# Altium project BugBuster_DAQ.PrjPcb (part 1 of 3)
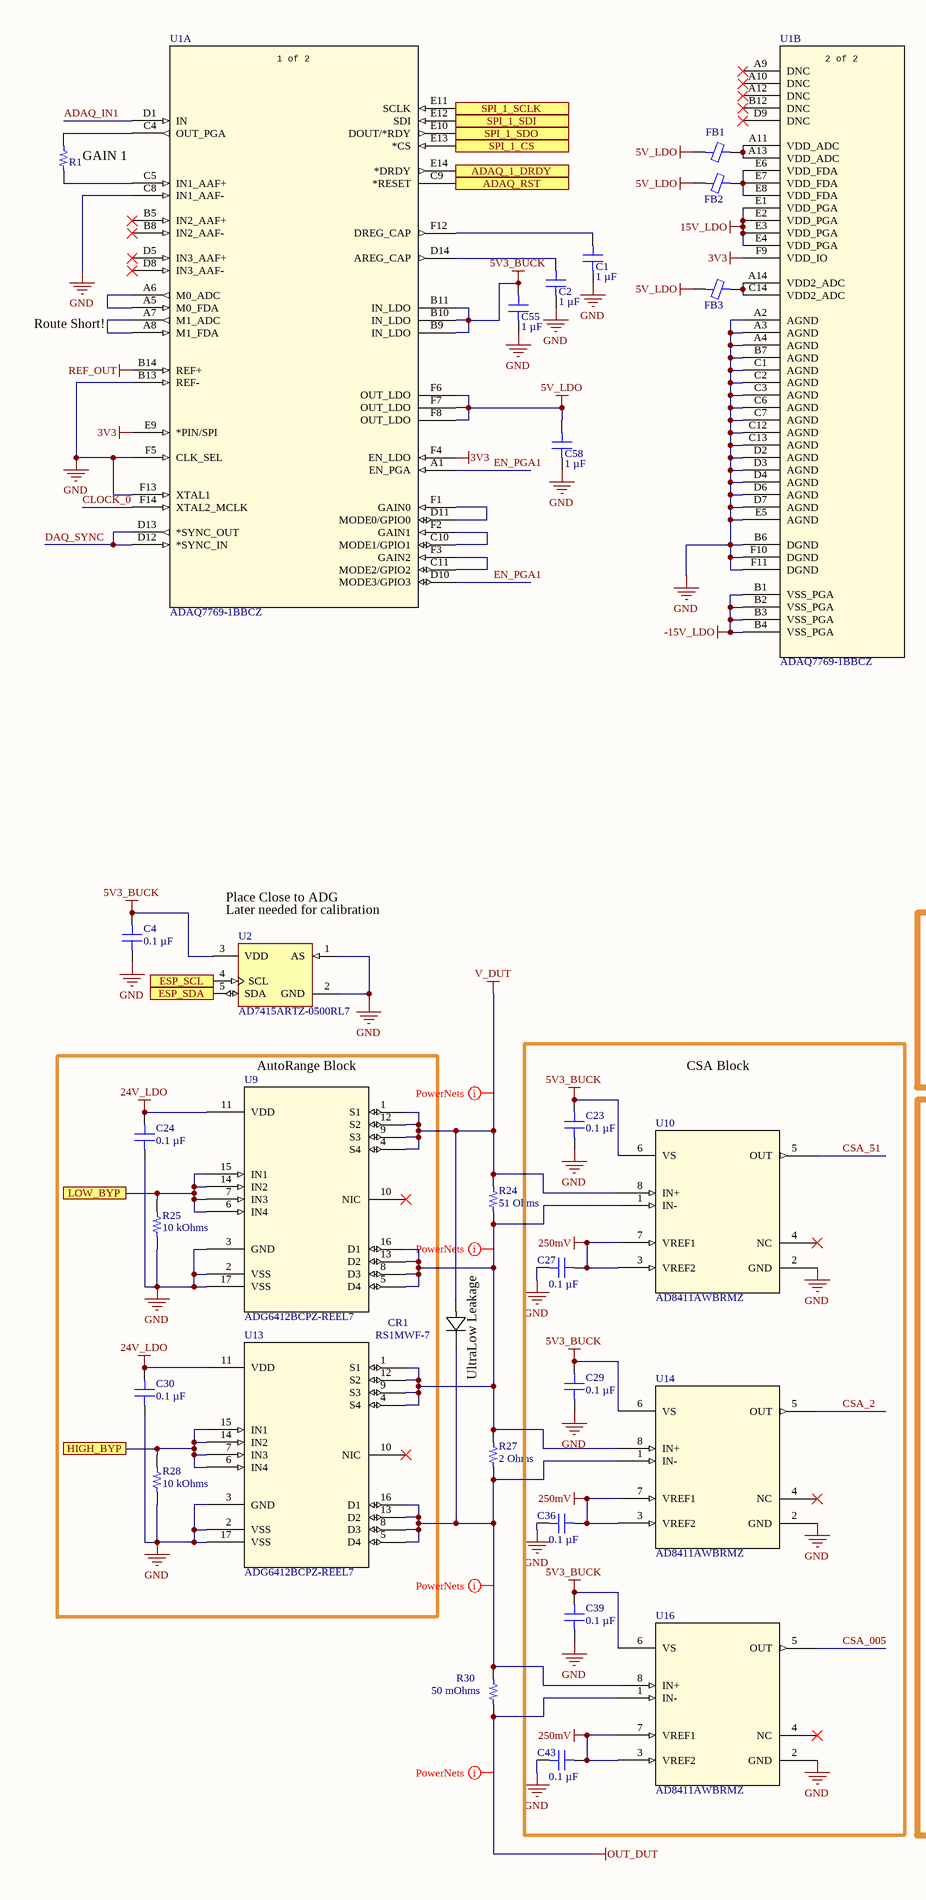
[diagram p0: DAQ.SchDoc, left]
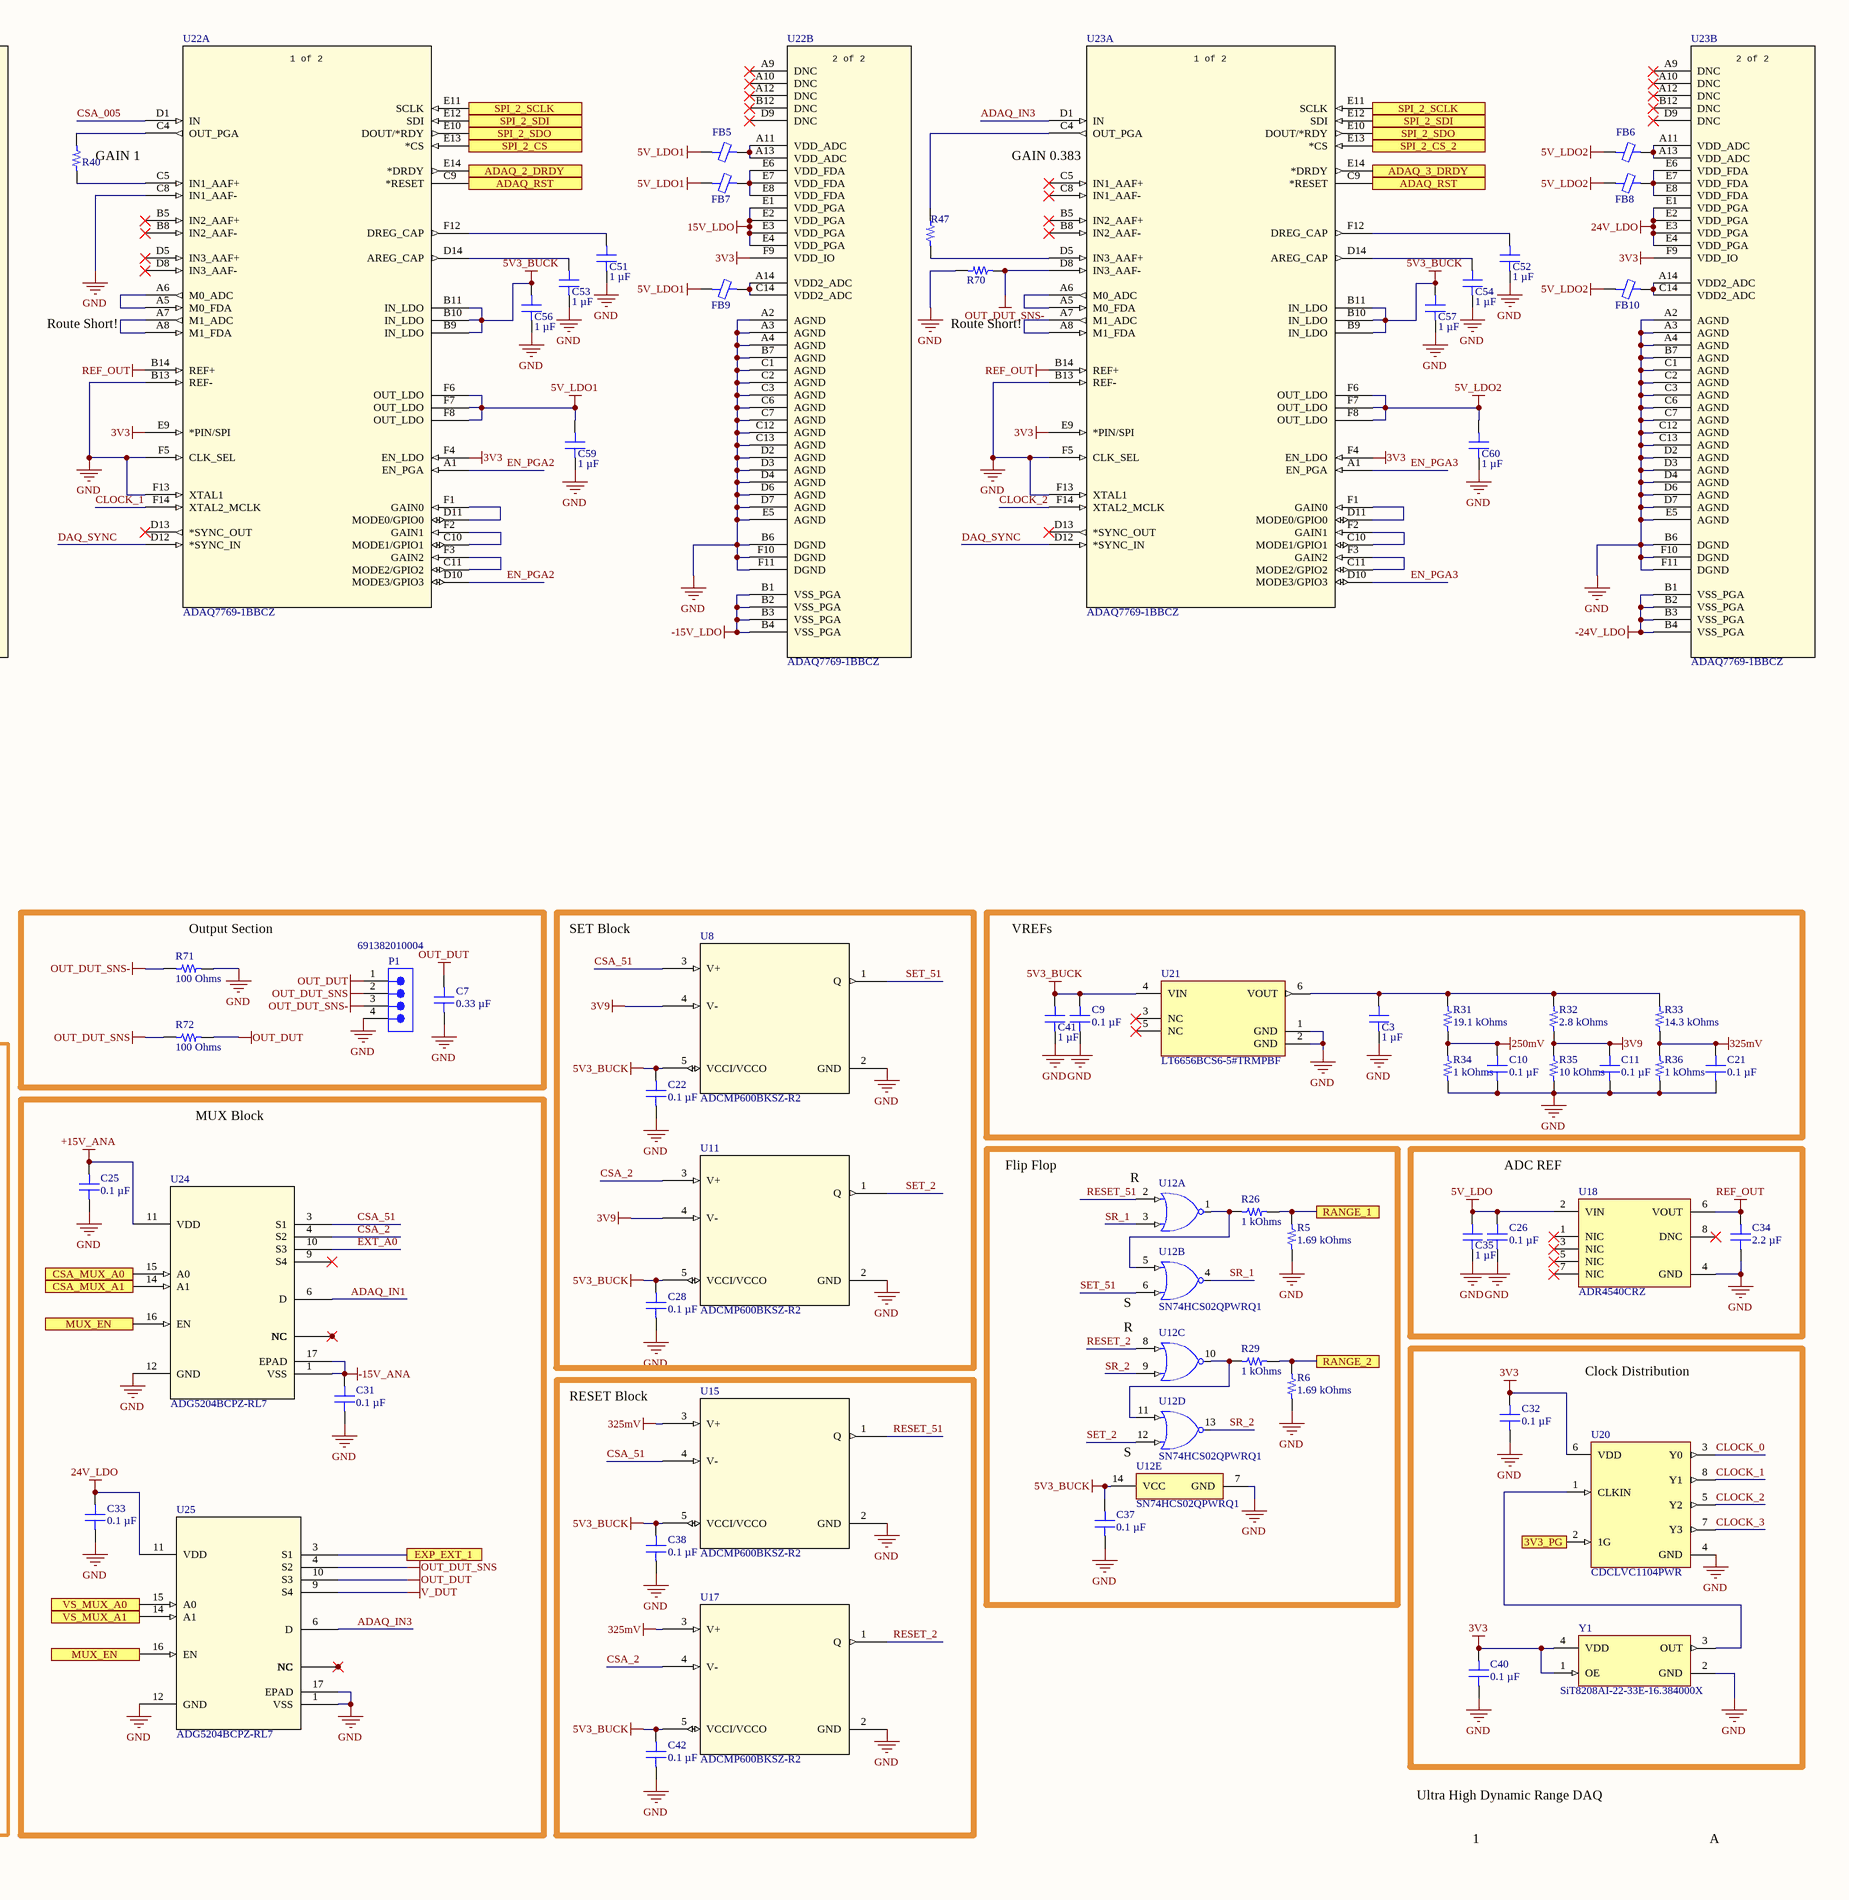
[diagram p1: DAQ.SchDoc, right]
5 sheets, 245 parts. Net scope: flat (ports and power ports of the same name join across sheets).
Board file: BugBuster_DAQ.PcbDoc
Sheets:
  DAQ.SchDoc
  Power.SchDoc
  IOs.SchDoc
  ESP32P4.SchDoc
  LCD.SchDoc

## Sheet DAQ.SchDoc
size A2; SheetNumber: 1; SheetTotal: 5

### Parts
C1  1 µF  [CAP 0603_1608]
C2  1 µF  [CAP 0603_1608]
C3  1 µF  [CAP 0603_1608]
C4  0.1 µF  [CAP 0603_1608]
C7  0.33 µF  [CAP 1206_3216 - 0.8MM]
C9  0.1 µF  [CAP 0603_1608]
C10  0.1 µF  [CAP 0603_1608]
C11  0.1 µF  [CAP 0603_1608]
C21  0.1 µF  [CAP 0603_1608]
C22  0.1 µF  [CAP 0603_1608]
C23  0.1 µF  [CAP 0603_1608]
C24  0.1 µF  [CAP 0603_1608]
C25  0.1 µF  [CAP 0603_1608]
C26  0.1 µF  [CAP 0603_1608]
C27  0.1 µF  [CAP 0603_1608]
C28  0.1 µF  [CAP 0603_1608]
C29  0.1 µF  [CAP 0603_1608]
C30  0.1 µF  [CAP 0603_1608]
C31  0.1 µF  [CAP 0603_1608]
C32  0.1 µF  [CAP 0603_1608]
C33  0.1 µF  [CAP 0603_1608]
C34  2.2 µF  [CAP 0805_2012]
C35  1 µF  [CAP 0603_1608]
C36  0.1 µF  [CAP 0603_1608]
C37  0.1 µF  [CAP 0603_1608]
C38  0.1 µF  [CAP 0603_1608]
C39  0.1 µF  [CAP 0603_1608]
C40  0.1 µF  [CAP 0603_1608]
C41  1 µF  [CAP 0603_1608]
C42  0.1 µF  [CAP 0603_1608]
C43  0.1 µF  [CAP 0603_1608]
C51  1 µF  [CAP 0603_1608]
C52  1 µF  [CAP 0603_1608]
C53  1 µF  [CAP 0603_1608]
C54  1 µF  [CAP 0603_1608]
C55  1 µF  [CAP 0603_1608]
C56  1 µF  [CAP 0603_1608]
C57  1 µF  [CAP 0603_1608]
C58  1 µF  [CAP 0603_1608]
C59  1 µF  [CAP 0603_1608]
C60  1 µF  [CAP 0603_1608]
CR1  RS1MWF-7  [SOD123F_RS1MWF_DIO]
FB1  1000 Ohms @ 100 MHz  [FER 0603_1608]  (value not drawn)
FB2  1000 Ohms @ 100 MHz  [FER 0603_1608]  (value not drawn)
FB3  1000 Ohms @ 100 MHz  [FER 0603_1608]  (value not drawn)
FB5  1000 Ohms @ 100 MHz  [FER 0603_1608]  (value not drawn)
FB6  1000 Ohms @ 100 MHz  [FER 0603_1608]  (value not drawn)
FB7  1000 Ohms @ 100 MHz  [FER 0603_1608]  (value not drawn)
FB8  1000 Ohms @ 100 MHz  [FER 0603_1608]  (value not drawn)
FB9  1000 Ohms @ 100 MHz  [FER 0603_1608]  (value not drawn)
FB10  1000 Ohms @ 100 MHz  [FER 0603_1608]  (value not drawn)
P1  691382010004  [691382010004]
R1  0 Ohms  [RES 0603_1608]  (value not drawn)
R5  1.69 kOhms  [RES 0603_1608]
R6  1.69 kOhms  [RES 0603_1608]
R24  51 Ohms  [STACKPOLE CSR2512]
R25  10 kOhms  [RES 0603_1608]
R26  1 kOhms  [RES 0603_1608]
R27  2 Ohms  [STACKPOLE CSR2512]
R28  10 kOhms  [RES 0603_1608]
R29  1 kOhms  [RES 0603_1608]
R30  50 mOhms  [TE TLRP 2512]
R31  19.1 kOhms  [RES 0603_1608]
R32  2.8 kOhms  [RES 0603_1608]
R33  14.3 kOhms  [RES 0603_1608]
R34  1 kOhms  [RES 0603_1608]
R35  10 kOhms  [RES 0603_1608]
R36  1 kOhms  [RES 0603_1608]
R40  0 Ohms  [RES 0603_1608]  (value not drawn)
R47  0 Ohms  [RES 0603_1608]  (value not drawn)
R70  0 Ohms  [RES 0603_1608]  (value not drawn)
R71  100 Ohms  [RES 0603_1608]
R72  100 Ohms  [RES 0603_1608]
U1  ADAQ7769-1BBCZ  [BC-84-4_ADI]  (parts A,B of 2)
U2  AD7415ARTZ-0500RL7  [ADI-RJ-5_M]
U8  ADCMP600BKSZ-R2  [ADI-KS-5_L]
U9  ADG6412BCPZ-REEL7  [CP_16_17_ADI]
U10  AD8411AWBRMZ  [RM-8_ADI]
U11  ADCMP600BKSZ-R2  [ADI-KS-5_L]
U12  SN74HCS02QPWRQ1  [FP-PW0014A-IPC_B]  (value not drawn)  (parts A,B,C,D,E of 5)
U13  ADG6412BCPZ-REEL7  [CP_16_17_ADI]
U14  AD8411AWBRMZ  [RM-8_ADI]
U15  ADCMP600BKSZ-R2  [ADI-KS-5_L]
U16  AD8411AWBRMZ  [RM-8_ADI]
U17  ADCMP600BKSZ-R2  [ADI-KS-5_L]
U18  ADR4540CRZ  [FP-R-8-IPC_C]
U20  CDCLVC1104PWR  [FP-PW0008A-MFG]
U21  LT6656BCS6-5#TRMPBF  [FP-S6-6-05-08-1636-IPC_B]
U22  ADAQ7769-1BBCZ  [BC-84-4_ADI]  (parts A,B of 2)
U23  ADAQ7769-1BBCZ  [BC-84-4_ADI]  (parts A,B of 2)
U24  ADG5204BCPZ-RL7  [CP_16_17_ADI]
U25  ADG5204BCPZ-RL7  [CP_16_17_ADI]
Y1  SiT8208AI-22-33E-16.384000X  [FP-SiT8208-2-MFG]

### Blocks framed on the sheet
Output Section: C7 P1 R71 R72
SET Block: C22 C28 U8 U11
VREFs: C3 C9-C11 C21 C41 R31-R36 U21
CSA Block: C23 C27 C29 C36 C39 C43 U10 U14 U16
AutoRange Block: C24 C30 R25 R28 U9 U13
MUX Block: C25 C31 C33 U24 U25
ADC REF: C26 C34 C35 U18
RESET Block: C38 C42 U15 U17
Clock Distribution: C32 C40 U20 Y1

### Ports
3V3_PG, ADAQ_1_DRDY, ADAQ_2_DRDY, ADAQ_3_DRDY, ADAQ_RST, CSA_MUX_A0, CSA_MUX_A1, ESP_SCL, ESP_SDA, EXP_EXT_1, HIGH_BYP, LOW_BYP, MUX_EN, RANGE_1, RANGE_2, SPI_1_CS, SPI_1_SCLK, SPI_1_SDI, SPI_1_SDO, SPI_2_CS, SPI_2_CS_2, SPI_2_SCLK, SPI_2_SDI, SPI_2_SDO, VS_MUX_A0, VS_MUX_A1

### Nets
3V3: C32.2 C40.2 U1.E9(*PIN/SPI) U1.F4(EN_LDO) U1.F9(VDD_IO) U20.6(VDD) U22.E9(*PIN/SPI) U22.F4(EN_LDO) U22.F9(VDD_IO) U23.E9(*PIN/SPI) U23.F4(EN_LDO) U23.F9(VDD_IO) Y1.1(OE) Y1.4(VDD)
3V9: C11.2 R32.1 R35.2 U8.4(V-) U11.4(V-)
5V3_BUCK: C4.2 C9.2 C22.2 C23.2 C28.2 C29.2 C37.2 C38.2 C39.2 C41.2 C42.2 C55.2 C56.2 C57.2 U1.B9(IN_LDO) U1.B10(IN_LDO) U1.B11(IN_LDO) U2.3(VDD) U8.5(VCCI/VCCO) U10.6(VS) U11.5(VCCI/VCCO) U12.14(VCC) U14.6(VS) U15.5(VCCI/VCCO) U16.6(VS) U17.5(VCCI/VCCO) U21.4(VIN) U22.B9(IN_LDO) U22.B10(IN_LDO) U22.B11(IN_LDO) U23.B9(IN_LDO) U23.B10(IN_LDO) U23.B11(IN_LDO)
5V_LDO: C26.2 C35.2 C58.2 FB1.1 FB2.1 FB3.1 U1.F6(OUT_LDO) U1.F7(OUT_LDO) U1.F8(OUT_LDO) U18.2(VIN)
5V_LDO1: C59.2 FB5.1 FB7.1 FB9.1 U22.F6(OUT_LDO) U22.F7(OUT_LDO) U22.F8(OUT_LDO)
5V_LDO2: C60.2 FB6.1 FB8.1 FB10.1 U23.F6(OUT_LDO) U23.F7(OUT_LDO) U23.F8(OUT_LDO)
15V_LDO: U1.E1(VDD_PGA) U1.E2(VDD_PGA) U1.E3(VDD_PGA) U1.E4(VDD_PGA) U22.E1(VDD_PGA) U22.E2(VDD_PGA) U22.E3(VDD_PGA) U22.E4(VDD_PGA)
24V_LDO: C24.2 C30.2 C33.2 U9.11(VDD) U13.11(VDD) U23.E1(VDD_PGA) U23.E2(VDD_PGA) U23.E3(VDD_PGA) U23.E4(VDD_PGA) U25.11(VDD)
250mV: C10.2 C27.1 C36.1 C43.1 R31.1 R34.2 U10.3(VREF2) U10.7(VREF1) U14.3(VREF2) U14.7(VREF1) U16.3(VREF2) U16.7(VREF1)
325mV: C21.2 R33.1 R36.2 U15.3(V+) U17.3(V+)
+15V_ANA: C25.2 U24.11(VDD)
-15V_ANA: C31.2 U24.1(VSS) U24.17(EPAD)
-15V_LDO: U1.B1(VSS_PGA) U1.B2(VSS_PGA) U1.B3(VSS_PGA) U1.B4(VSS_PGA) U22.B1(VSS_PGA) U22.B2(VSS_PGA) U22.B3(VSS_PGA) U22.B4(VSS_PGA)
-24V_LDO: U23.B1(VSS_PGA) U23.B2(VSS_PGA) U23.B3(VSS_PGA) U23.B4(VSS_PGA)
GND: C1.1 C2.1 C3.1 C4.1 C7.1 C9.1 C10.1 C11.1 C21.1 C22.1 C23.1 C24.1 C25.1 C26.1 C27.2 C28.1 C29.1 C30.1 C31.1 C32.1 C33.1 C34.1 C35.1 C36.2 C37.1 C38.1 C39.1 C40.1 C41.1 C42.1 C43.2 C51.1 C52.1 C53.1 C54.1 C55.1 C56.1 C57.1 C58.1 C59.1 C60.1 P1.4 R5.1 R6.1 R25.1 R28.1 R34.1 R35.1 R36.1 R70.2 R71.2 U1.A2(AGND) U1.A3(AGND) U1.A4(AGND) U1.B6(DGND) U1.B7(AGND) U1.B13(REF-) U1.C1(AGND) U1.C2(AGND) U1.C3(AGND) U1.C6(AGND) U1.C7(AGND) U1.C8(IN1_AAF-) U1.C12(AGND) U1.C13(AGND) U1.D2(AGND) U1.D3(AGND) U1.D4(AGND) U1.D6(AGND) U1.D7(AGND) U1.E5(AGND) U1.F5(CLK_SEL) U1.F10(DGND) U1.F11(DGND) U1.F13(XTAL1) U2.1(AS) U2.2(GND) U8.2(GND) U9.2(VSS) U9.3(GND) U9.17(VSS) U10.2(GND) U11.2(GND) U12.7(GND) U13.2(VSS) U13.3(GND) U13.17(VSS) U14.2(GND) U15.2(GND) U16.2(GND) U17.2(GND) U18.4(GND) U20.4(GND) U21.1(GND) U21.2(GND) U22.A2(AGND) U22.A3(AGND) U22.A4(AGND) U22.B6(DGND) U22.B7(AGND) U22.B13(REF-) U22.C1(AGND) U22.C2(AGND) U22.C3(AGND) U22.C6(AGND) U22.C7(AGND) U22.C8(IN1_AAF-) U22.C12(AGND) U22.C13(AGND) U22.D2(AGND) U22.D3(AGND) U22.D4(AGND) U22.D6(AGND) U22.D7(AGND) U22.E5(AGND) U22.F5(CLK_SEL) U22.F10(DGND) U22.F11(DGND) U22.F13(XTAL1) U23.A2(AGND) U23.A3(AGND) U23.A4(AGND) U23.B6(DGND) U23.B7(AGND) U23.B13(REF-) U23.C1(AGND) U23.C2(AGND) U23.C3(AGND) U23.C6(AGND) U23.C7(AGND) U23.C12(AGND) U23.C13(AGND) U23.D2(AGND) U23.D3(AGND) U23.D4(AGND) U23.D6(AGND) U23.D7(AGND) U23.E5(AGND) U23.F5(CLK_SEL) U23.F10(DGND) U23.F11(DGND) U23.F13(XTAL1) U24.12(GND) U25.1(VSS) U25.12(GND) U25.17(EPAD) Y1.2(GND)
OUT_DUT: C7.2 P1.1 R30.1 R72.2 U16.1(IN-) U25.10(S3)
OUT_DUT_SNS: P1.2 R72.1 U25.4(S2)
OUT_DUT_SNS-: P1.3 R70.1 R71.1 U23.D8(IN3_AAF-)
REF_OUT: C34.2 U1.B14(REF+) U18.6(VOUT) U22.B14(REF+) U23.B14(REF+)
V_DUT: CR1.2 R24.2 U9.1(S1) U9.4(S4) U9.9(S3) U9.12(S2) U10.8(IN+) U25.9(S4)
ADAQ_IN1: U1.D1(IN) U24.6(D)
ADAQ_IN3: U23.D1(IN) U25.6(D)
CLOCK_0: U1.F14(XTAL2_MCLK) U20.3(Y0)
CLOCK_1: U20.8(Y1) U22.F14(XTAL2_MCLK)
CLOCK_2: U20.5(Y2) U23.F14(XTAL2_MCLK)
CLOCK_3: U20.7(Y3)
CSA_2: U11.3(V+) U14.5(OUT) U17.4(V-) U24.4(S2)
CSA_005: U16.5(OUT) U22.D1(IN)
CSA_51: U8.3(V+) U10.5(OUT) U15.4(V-) U24.3(S1)
DAQ_SYNC: U1.D12(*SYNC_IN) U1.D13(*SYNC_OUT) U22.D12(*SYNC_IN) U23.D12(*SYNC_IN)
EN_PGA1: U1.A1(EN_PGA) U1.D10(MODE3/GPIO3)
EN_PGA2: U22.A1(EN_PGA) U22.D10(MODE3/GPIO3)
EN_PGA3: U23.A1(EN_PGA) U23.D10(MODE3/GPIO3)
EXT_A0: U24.10(S3)
RESET_2: U12.8(3A) U17.1(Q)
RESET_51: U12.2(1A) U15.1(Q)
SET_2: U11.1(Q) U12.12(4B)
SET_51: U8.1(Q) U12.6(2B)
SR_1: U12.3(1B) U12.4(2Y)
SR_2: U12.9(3B) U12.13(4Y)
NetC1_2: C1.2 U1.F12(DREG_CAP)
NetC2_2: C2.2 U1.D14(AREG_CAP)
NetC3_2: C3.2 R31.2 R32.2 R33.2 U21.6(VOUT)
NetC51_2: C51.2 U22.F12(DREG_CAP)
NetC52_2: C52.2 U23.F12(DREG_CAP)
NetC53_2: C53.2 U22.D14(AREG_CAP)
NetC54_2: C54.2 U23.D14(AREG_CAP)
NetCR1_1: CR1.1 R27.2 R30.2 U13.5(D4) U13.8(D3) U13.13(D2) U13.16(D1) U14.1(IN-) U16.8(IN+)
NetFB1_2: FB1.2 U1.A11(VDD_ADC) U1.A13(VDD_ADC)
NetFB2_2: FB2.2 U1.E6(VDD_FDA) U1.E7(VDD_FDA) U1.E8(VDD_FDA)
NetFB3_2: FB3.2 U1.A14(VDD2_ADC) U1.C14(VDD2_ADC)
NetFB5_2: FB5.2 U22.A11(VDD_ADC) U22.A13(VDD_ADC)
NetFB6_2: FB6.2 U23.A11(VDD_ADC) U23.A13(VDD_ADC)
NetFB7_2: FB7.2 U22.E6(VDD_FDA) U22.E7(VDD_FDA) U22.E8(VDD_FDA)
NetFB8_2: FB8.2 U23.E6(VDD_FDA) U23.E7(VDD_FDA) U23.E8(VDD_FDA)
NetFB9_2: FB9.2 U22.A14(VDD2_ADC) U22.C14(VDD2_ADC)
NetFB10_2: FB10.2 U23.A14(VDD2_ADC) U23.C14(VDD2_ADC)
NetJ3_2: U25.3(S1) ; port EXP_EXT_1
NetR1_1: R1.1 U1.C5(IN1_AAF+)
NetR1_2: R1.2 U1.C4(OUT_PGA)
NetR5_2: R5.2 R26.1 ; port RANGE_1
NetR6_2: R6.2 R29.1 ; port RANGE_2
NetR24_1: R24.1 R27.1 U9.5(D4) U9.8(D3) U9.13(D2) U9.16(D1) U10.1(IN-) U13.1(S1) U13.4(S4) U13.9(S3) U13.12(S2) U14.8(IN+)
NetR25_2: R25.2 U9.6(IN4) U9.7(IN3) U9.14(IN2) U9.15(IN1) ; port LOW_BYP
NetR26_2: R26.2 U12.1(1Y) U12.5(2A)
NetR28_2: R28.2 U13.6(IN4) U13.7(IN3) U13.14(IN2) U13.15(IN1) ; port HIGH_BYP
NetR29_2: R29.2 U12.10(3Y) U12.11(4A)
NetR40_1: R40.1 U22.C5(IN1_AAF+)
NetR40_2: R40.2 U22.C4(OUT_PGA)
NetR47_1: R47.1 U23.D5(IN3_AAF+)
NetR47_2: R47.2 U23.C4(OUT_PGA)
NetR51_1: U20.2(1G) ; port 3V3_PG
NetR68_1: U2.5(SDA) ; port ESP_SDA
NetR69_1: U2.4(SCL) ; port ESP_SCL
NetU1_A5: U1.A5(M0_FDA) U1.A6(M0_ADC)
NetU1_A7: U1.A7(M1_ADC) U1.A8(M1_FDA)
NetU1_C9: U1.C9(*RESET) U22.C9(*RESET) U23.C9(*RESET) ; port ADAQ_RST
NetU1_C10: U1.C10(MODE1/GPIO1) U1.F2(GAIN1)
NetU1_C11: U1.C11(MODE2/GPIO2) U1.F3(GAIN2)
NetU1_D11: U1.D11(MODE0/GPIO0) U1.F1(GAIN0)
NetU1_E10: U1.E10(DOUT/*RDY) ; port SPI_1_SDO
NetU1_E11: U1.E11(SCLK) ; port SPI_1_SCLK
NetU1_E12: U1.E12(SDI) ; port SPI_1_SDI
NetU1_E13: U1.E13(*CS) ; port SPI_1_CS
NetU1_E14: U1.E14(*DRDY) ; port ADAQ_1_DRDY
NetU20_1: U20.1(CLKIN) Y1.3(OUT)
NetU22_A5: U22.A5(M0_FDA) U22.A6(M0_ADC)
NetU22_A7: U22.A7(M1_ADC) U22.A8(M1_FDA)
NetU22_C10: U22.C10(MODE1/GPIO1) U22.F2(GAIN1)
NetU22_C11: U22.C11(MODE2/GPIO2) U22.F3(GAIN2)
NetU22_D11: U22.D11(MODE0/GPIO0) U22.F1(GAIN0)
NetU22_E10: U22.E10(DOUT/*RDY) U23.E10(DOUT/*RDY) ; port SPI_2_SDO
NetU22_E11: U22.E11(SCLK) U23.E11(SCLK) ; port SPI_2_SCLK
NetU22_E12: U22.E12(SDI) U23.E12(SDI) ; port SPI_2_SDI
NetU22_E13: U22.E13(*CS) ; port SPI_2_CS
NetU22_E14: U22.E14(*DRDY) ; port ADAQ_2_DRDY
NetU23_A5: U23.A5(M0_FDA) U23.A6(M0_ADC)
NetU23_A7: U23.A7(M1_ADC) U23.A8(M1_FDA)
NetU23_C10: U23.C10(MODE1/GPIO1) U23.F2(GAIN1)
NetU23_C11: U23.C11(MODE2/GPIO2) U23.F3(GAIN2)
NetU23_D11: U23.D11(MODE0/GPIO0) U23.F1(GAIN0)
NetU23_E13: U23.E13(*CS) ; port SPI_2_CS_2
NetU23_E14: U23.E14(*DRDY) ; port ADAQ_3_DRDY
NetU24_2: U24.2(NC) U24.5(NC) U24.7(NC) U24.8(NC) U24.13(NC)
NetU24_14: U24.14(A1) ; port CSA_MUX_A1
NetU24_15: U24.15(A0) ; port CSA_MUX_A0
NetU24_16: U24.16(EN) U25.16(EN) ; port MUX_EN
NetU25_2: U25.2(NC) U25.5(NC) U25.7(NC) U25.8(NC) U25.13(NC)
NetU25_14: U25.14(A1) ; port VS_MUX_A1
NetU25_15: U25.15(A0) ; port VS_MUX_A0

Not connected (* = marked no-connect by the designer): U1 A9(DNC)* A10(DNC)* A12(DNC)* B5(IN2_AAF+)* B8(IN2_AAF-)* B12(DNC)* D5(IN3_AAF+)* D8(IN3_AAF-)* D9(DNC)*; U9 10(NIC)*; U10 4(NC)*; U13 10(NIC)*; U14 4(NC)*; U16 4(NC)*; U18 1(NIC)* 3(NIC)* 5(NIC)* 7(NIC)* 8(DNC)*; U21 3(NC)* 5(NC)*; U22 A9(DNC)* A10(DNC)* A12(DNC)* B5(IN2_AAF+)* B8(IN2_AAF-)* B12(DNC)* D5(IN3_AAF+)* D8(IN3_AAF-)* D9(DNC)* D13(*SYNC_OUT)*; U23 A9(DNC)* A10(DNC)* A12(DNC)* B5(IN2_AAF+)* B8(IN2_AAF-)* B12(DNC)* C5(IN1_AAF+)* C8(IN1_AAF-)* D9(DNC)* D13(*SYNC_OUT)*; U24 9(S4)*

### Layout directives
net class PowerNets: NetCR1_1, NetR24_1, OUT_DUT, V_DUT

### Notes on the sheet
- (near R1) GAIN 1
- (near R40) GAIN 1
- (near U23) GAIN 0.383
- Route Short!
- Place Close to ADG
- (near U2) Later needed for calibration
- Flip Flop
- (near U12) R
- (near U12) S
- (near CR1) UltraLow Leakage
- Ultra High Dynamic Range DAQ
- 1
- A
- (in symbol ADAQ7769-1BBCZ, part A) 1 of 2
- (in symbol ADAQ7769-1BBCZ, part B) 2 of 2

### Library data of the parts
C1-C3 C35 C41 C51-C60 = GMC10X7R105M50NT: SMT Capacitor; manufacturer: Cal-Chip Electronics, Inc.; Temperature Coefficient: X7R; Tolerance: ±20%; Voltage - Rated: 50V; Part Number: GMC10X7R105M50NT; Applications: General Purpose; Capacitance: 1 µF; componentlink1description: Datasheet; componentlink1url: https://calchip.com/wp-content/uploads/2024/02/gmc_series-1.pdf; componentlink2description: DigiKey Link; componentlink2url: https://www.digikey.com/en/products/detail/cal-chip-electronics-inc/GMC10X7R105M50NT/25323876; Device Package: 0603 (1608 Metric); lastupdated: 06/04/2026 19:17:52; Lifecycle Status: Active; Minimum Order: 1; Mounting Type: Surface Mount, MLCC; Operating Temperature: -55°C ~ 125°C; Package / Case: 0603 (1608 Metric); packaging: TapeAndReel; partid: 65934; price: 0.06; series: GMC; Size / Dimension: 0.063" L x 0.031" W (1.60mm x 0.80mm); Supplier 1: DigiKey; Supplier Part Number 1: 4713-GMC10X7R105M50NTCT-ND; Thickness (Max): 0.037" (0.95mm); value: 1 µF
C4 C9-C11 C21-C33 C36-C40 C42 C43 = C0603C104M5RACTU: SMT Capacitor; manufacturer: KEMET; Temperature Coefficient: X7R; Tolerance: ±20%; Voltage - Rated: 50V; Part Number: C0603C104M5RACTU; value: 0.1 µF; Applications: Bypass, Decoupling; Capacitance: 0.1 µF; componentlink1description: Datasheet; componentlink1url: https://api.kemet.com/component-edge/download/datasheet/C0603C104M5RACTU.pdf; componentlink2description: DigiKey Link; componentlink2url: https://www.digikey.com/en/products/detail/kemet/C0603C104M5RACTU/2199782; Device Package: 0603 (1608 Metric); lastupdated: 06/04/2026 19:22:47; Lifecycle Status: Active; Minimum Order: 1; Mounting Type: Surface Mount, MLCC; Operating Temperature: -55°C ~ 125°C; Package / Case: 0603 (1608 Metric); packaging: CutTape; partid: 69106; Part Status: Active; price: 0.01; series: SMD Comm X7R; Size / Dimension: 0.063" L x 0.031" W (1.60mm x 0.80mm); Supplier 1: DigiKey; Supplier Part Number 1: 399-C0603C104M5RACTUCT-ND; Thickness (Max): 0.034" (0.87mm)
C7 = CGA5L3X8R2A334K160AB: SMT Capacitor; manufacturer: TDK Corporation; Temperature Coefficient: X8R; Tolerance: ±10%; Voltage - Rated: 100V; Part Number: CGA5L3X8R2A334K160AB; Applications: Automotive; Capacitance: 0.33 µF; componentlink1description: Datasheet; componentlink1url: https://product.tdk.com/info/en/catalog/datasheets/mlcc_automotive_hightemp_en.pdf?ref_disty=digikey; componentlink2description: DigiKey Link; componentlink2url: https://www.digikey.com/en/products/detail/tdk-corporation/CGA5L3X8R2A334K160AB/3950213; Device Package: 1206 (3216 Metric); Features: High Temperature; lastupdated: 06/04/2026 19:37:59; Lifecycle Status: Active; Minimum Order: 1; Mounting Type: Surface Mount, MLCC; Operating Temperature: -55°C ~ 150°C; Package / Case: 1206 (3216 Metric); packaging: TapeAndReel; partid: 19758; Part Status: Active; price: 0.15; Ratings: AEC-Q200; series: CGA; Size / Dimension: 0.126" L x 0.063" W (3.20mm x 1.60mm); Supplier 1: DigiKey; Supplier Part Number 1: 445-12977-1-ND; Thickness (Max): 0.071" (1.80mm); value: 0.33 µF
C34 = GMC21X7R225M35NT: SMT Capacitor; manufacturer: Cal-Chip Electronics, Inc.; Temperature Coefficient: X7R; Tolerance: ±20%; Voltage - Rated: 35V; Part Number: GMC21X7R225M35NT; value: 2.2 µF; Applications: General Purpose; Capacitance: 2.2 µF; componentlink1description: Datasheet; componentlink1url: https://calchip.com/wp-content/uploads/2024/02/gmc_series-1.pdf; componentlink2description: DigiKey Link; componentlink2url: https://www.digikey.com/en/products/detail/cal-chip-electronics-inc/GMC21X7R225M35NT/25803563; Device Package: 0805 (2012 Metric); lastupdated: 06/04/2026 19:28:46; Lifecycle Status: Active; Minimum Order: 1; Mounting Type: Surface Mount, MLCC; Operating Temperature: -55°C ~ 125°C; Package / Case: 0805 (2012 Metric); packaging: TapeAndReel; partid: 69969; price: 0.14; series: GMC; Size / Dimension: 0.079" L x 0.049" W (2.00mm x 1.25mm); Supplier 1: DigiKey; Supplier Part Number 1: 4713-GMC21X7R225M35NTCT-ND; Thickness (Max): 0.057" (1.45mm)
CR1 = RS1MWF-7: DIODE STANDARD 1000V 1A SOD123F; Manufacturer_Name: Diodes Inc; Copyright: Copyright (C) 2026 Ultra Librarian. All rights reserved.; Manufacturer_Part_Number: RS1MWF-7
FB1-FB3 FB5-FB10 = WLBD1608HCU102TH: FERRITE BEAD 1000 OHM 0603 1LN; Manufacturer: Walsin Technology Corporation; Current Rating (Max): 1.3A; DC Resistance (DCR) (Max): 150mOhm; Number of Lines: 1; Part Number: WLBD1608HCU102TH; ComponentLink1Description: Datasheet; ComponentLink1URL: https://www.passivecomponent.com/wp-content/uploads/inductor/WLBD1005-4532_HC_Series.pdf; ComponentLink2Description: DigiKey Link; ComponentLink2URL: https://www.digikey.com/en/products/detail/walsin-technology-corporation/WLBD1608HCU102TH/14563787; Device Package: 0603 (1608 Metric); Height (Max): 0.026" (0.65mm); Impedance @ Frequency: 1000 Ohms @ 100 MHz; LastUpdated: 05/04/2026 20:27:58; Lifecycle Status: Active; Minimum Order: 1; Mounting Type: Surface Mount; Operating Temperature: -55°C ~ 125°C; Package / Case: 0603 (1608 Metric); Packaging: TapeAndReel; PartId: 2833; Part Status: Active; Price: 0.01; Series: -; Size / Dimension: 0.047" L x 0.025" W (1.19mm x 0.64mm); Supplier 1: DigiKey; Supplier Part Number 1: 1292-WLBD1608HCU102THCT-ND; Value: 1000 Ohms @ 100 MHz
P1 = CMP-1502-01745-3: Terminal Block, R/A Header, 4Pos, Th Rohs Compliant: Yes; Pitch: 2.4892mm; Gender: Male; Number of Positions Per Level: 4; Voltage: 300V; Current: 12A; Number of Levels: 1; Packaging: Box; Number of Pins: 4; Lead Pitch: 2.5mm; Color: Green; Max Operating Temperature: 105°C; Number of Positions: 4; Contact Plating: Tin; Mount: Through Hole; Termination: Solder; Min Operating Temperature: -40°C; RoHS: Compliant
R1 R40 R47 R70 = WSL060300000ZEA9: RES 0 OHM JUMPER 0603; Manufacturer: Vishay Dale; Temperature Coefficient: ±3900ppm/°C; Part Number: WSL060300000ZEA9; ComponentLink1Description: Datasheet; ComponentLink1URL: http://www.vishay.com/docs/30192/wsl-9.pdf; ComponentLink2Description: DigiKey Link; ComponentLink2URL: https://www.digikey.com/en/products/detail/vishay-dale/WSL060300000ZEA9/7423217; Composition: Metal Element; Device Package: 0603 (1608 Metric); Height - Seated (Max): 0.021" (0.53mm); LastUpdated: 09/02/2024 20:43:09; Lifecycle Status: Active; Minimum Order: 1; Number of Terminations: 2; Operating Temperature: -65°C ~ 170°C; Package / Case: 0603 (1608 Metric); Packaging: TapeAndReel; PartId: 11865; Part Status: Active; Price: 0.39; Resistance: 0 Ohms; Series: WSL; Size / Dimension: 0.060" L x 0.030" W (1.52mm x 0.76mm); Supplier 1: DigiKey; Supplier Part Number 1: 541-3927-1-ND; Supplier Device Package: 0603; Tolerance: Jumper; Value: 0 Ohms
R5 R6 = CRCW06031K69FKEAC: RES 1.69K OHM 1% 1/10W 0603; Manufacturer: Vishay Dale; Power (Watts): 0.1W, 1/10W; Temperature Coefficient: ±100ppm/°C; Part Number: CRCW06031K69FKEAC; Value: 1.69 kOhms; ComponentLink1Description: Datasheet; ComponentLink1URL: https://www.vishay.com/docs/28773/crcwce3.pdf; ComponentLink2Description: DigiKey Link; ComponentLink2URL: https://www.digikey.com/en/products/detail/vishay-dale/CRCW06031K69FKEAC/7924250; Composition: Thick Film; Device Package: 0603 (1608 Metric); Height - Seated (Max): 0.022" (0.55mm); LastUpdated: 09/02/2024 20:41:16; Lifecycle Status: Active; Minimum Order: 1; Number of Terminations: 2; Operating Temperature: -55°C ~ 155°C; Package / Case: 0603 (1608 Metric); Packaging: TapeAndReel; PartId: 65693; Part Status: Active; Price: 0.01; Resistance: 1.69 kOhms; Series: CRCW-C; Size / Dimension: 0.063" L x 0.031" W (1.60mm x 0.80mm); Supplier 1: DigiKey; Supplier Part Number 1: 541-5240-1-ND; Supplier Device Package: 0603; Tolerance: ±1%
R24 = CRM2512-JW-510ELF: RES SMD 51 OHM 5% 2W 2512; Manufacturer: Bourns Inc.; Temperature Coefficient: ±200ppm/°C; Part Number: CRM2512-JW-510ELF; ComponentLink1Description: Datasheet; ComponentLink1URL: https://www.bourns.com/docs/Product-Datasheets/CRM.pdf; ComponentLink2Description: DigiKey Link; ComponentLink2URL: http://digikey.com/product-detail/en/bourns-inc/CRM2512-JW-510ELF/118-CRM2512-JW-510ELFCT-ND/10673704; Composition: Thick Film; Device Package: 2512 (6432 Metric); Features: Current Sense; Height - Seated (Max): 0.031" (0.80mm); LastUpdated: 02/09/2020 01:18:04; Lifecycle Status: Active; Minimum Order: 1; Number of Terminations: 2; Operating Temperature: -55°C ~ 155°C; Package / Case: 2512 (6432 Metric); Packaging: TapeAndReel; PartId: 1920; Part Status: Active; Power (Watts): 2W; Price: 0.06; Resistance: 51 Ohms; Series: CRM2512; Size / Dimension: 0.248" L x 0.122" W (6.30mm x 3.10mm); Supplier 1: DigiKey; Supplier Part Number 1: 118-CRM2512-JW-510ELFCT-ND; Supplier Device Package: 2512; Tolerance: ±5%; Value: 51 Ohms
R25 R28 R35 = ERJ-PA3F1002V: RES SMD 10K OHM 1% 1/3W 0603; Manufacturer: Panasonic Electronic Components; Power (Watts): 0.333W 1/3W; Temperature Coefficient: ±100ppm/°C; ComponentLink1Description: Datasheet; ComponentLink1URL: https://industrial.panasonic.com/cdbs/www-data/pdf/RDO0000/AOA0000C331.pdf; ComponentLink2Description: DigiKey Link; ComponentLink2URL: https://www.digikey.com/en/products/detail/panasonic-electronic-components/ERJ-PA3F1002V/5035849; Composition: Thick Film; Device Package: 0603 (1608 Metric); Features: Automotive AEC-Q200 Pulse Withstanding; Height - Seated (Max): 0.022\ (0.55mm); LastUpdated: 2024-02-09 20:42:57.847000; Lifecycle Status: Active; Part Number: ERJ-PA3F1002V; Minimum Order: 1; Number of Terminations: 2; Operating Temperature: -55°C ~ 155°C; Package / Case: 0603 (1608 Metric); Packaging: TapeAndReel; PartId: 14698; Part Status: Active; Price: 0.01; Ratings: AEC-Q200; Resistance: 10 kOhms; Series: ERJ-PA3; Size / Dimension: 0.063\ L x 0.031\ W (1.60mm x 0.80mm); Supplier 1: DigiKey; Supplier Part Number 1: P10KBYCT-ND; Supplier Device Package: 0603; Tolerance: ±1%; Value: 10 kOhms
R26 R29 R34 R36 = ERJ-PA3F1001V: RES SMD 1K OHM 1% 1/3W 0603; Manufacturer: Panasonic Electronic Components; Power (Watts): 0.333W 1/3W; Temperature Coefficient: ±100ppm/°C; ComponentLink1Description: Datasheet; ComponentLink1URL: https://industrial.panasonic.com/cdbs/www-data/pdf/RDO0000/AOA0000C331.pdf; ComponentLink2Description: DigiKey Link; ComponentLink2URL: https://www.digikey.com/en/products/detail/panasonic-electronic-components/ERJ-PA3F1001V/5035848; Composition: Thick Film; Device Package: 0603 (1608 Metric); Features: Automotive AEC-Q200 Pulse Withstanding; Height - Seated (Max): 0.022\ (0.55mm); LastUpdated: 2024-02-09 20:42:57.220000; Lifecycle Status: Active; Part Number: ERJ-PA3F1001V; Minimum Order: 1; Number of Terminations: 2; Operating Temperature: -55°C ~ 155°C; Package / Case: 0603 (1608 Metric); Packaging: TapeAndReel; PartId: 14885; Part Status: Active; Price: 0.01; Ratings: AEC-Q200; Resistance: 1 kOhms; Series: ERJ-PA3; Size / Dimension: 0.063\ L x 0.031\ W (1.60mm x 0.80mm); Supplier 1: DigiKey; Supplier Part Number 1: P1.0KBYCT-ND; Supplier Device Package: 0603; Tolerance: ±1%; Value: 1 kOhms
R27 = CRM2512-FX-2R00ELF: RES SMD 2 OHM 1% 2W 2512; Manufacturer: Bourns Inc.; Temperature Coefficient: ±100ppm/°C; Part Number: CRM2512-FX-2R00ELF; ComponentLink1Description: Datasheet; ComponentLink1URL: https://www.bourns.com/docs/Product-Datasheets/CRM.pdf; ComponentLink2Description: DigiKey Link; ComponentLink2URL: http://digikey.com/product-detail/en/bourns-inc/CRM2512-FX-2R00ELF/CRM2512-FX-2R00ELFCT-ND/9677732; Composition: Thick Film; Device Package: 2512 (6432 Metric); Features: Current Sense; Height - Seated (Max): 0.031" (0.80mm); LastUpdated: 02/09/2020 01:18:05; Lifecycle Status: Active; Minimum Order: 1; Number of Terminations: 2; Operating Temperature: -55°C ~ 155°C; Package / Case: 2512 (6432 Metric); Packaging: TapeAndReel; PartId: 1870; Part Status: Active; Power (Watts): 2W; Price: 0.10; Resistance: 2 Ohms; Series: CRM2512; Size / Dimension: 0.248" L x 0.122" W (6.30mm x 3.10mm); Supplier 1: DigiKey; Supplier Part Number 1: CRM2512-FX-2R00ELFCT-ND; Supplier Device Package: 2512; Tolerance: ±1%; Value: 2 Ohms
R30 = TLRP3A20WR050FTE: RES 0.05 OHM 1% 2W 2512; Manufacturer: TE Connectivity Passive Product; Temperature Coefficient: ±75ppm/°C; Part Number: TLRP3A20WR050FTE; ComponentLink1Description: Datasheet; ComponentLink1URL: https://www.te.com/commerce/DocumentDelivery/DDEController?Action=srchrtrv&DocNm=1773449-4&DocType=DS&DocLang=English; ComponentLink2Description: DigiKey Link; ComponentLink2URL: https://www.digikey.com/en/products/detail/te-connectivity-passive-product/TLRP3A20WR050FTE/14652078; Composition: Metal Element; Device Package: 2512 (6332 Metric); Features: Anti-Sulfur, Automotive AEC-Q200, Current Sense; Height - Seated (Max): 0.035" (0.90mm); LastUpdated: 05/04/2026 21:05:23; Lifecycle Status: Active; Minimum Order: 1; Number of Terminations: 2; Operating Temperature: -55°C ~ 170°C; Package / Case: 2512 (6332 Metric); Packaging: TapeAndReel; PartId: 3243; Part Status: Active; Power (Watts): 2W; Price: 0.14; Ratings: AEC-Q200; Resistance: 50 mOhms; Series: TLRP; Size / Dimension: 0.252" L x 0.126" W (6.40mm x 3.20mm); Supplier 1: DigiKey; Supplier Part Number 1: 1712-TLRP3A20WR050FTECT-ND; Supplier Device Package: 2512; Tolerance: ±1%; Value: 50 mOhms
R31 = ERJ-3EKF1912V: RES SMD 19.1K OHM 1% 1/10W 0603; Manufacturer: Panasonic Electronic Components; Power (Watts): 0.1W 1/10W; Temperature Coefficient: ±100ppm/°C; ComponentLink1Description: Datasheet; ComponentLink1URL: https://industrial.panasonic.com/cdbs/www-data/pdf/RDA0000/AOA0000C304.pdf; ComponentLink2Description: DigiKey Link; ComponentLink2URL: https://www.digikey.com/en/products/detail/panasonic-electronic-components/ERJ-3EKF1912V/196175; Composition: Thick Film; Device Package: 0603 (1608 Metric); Features: Automotive AEC-Q200; Height - Seated (Max): 0.022\ (0.55mm); LastUpdated: 2024-02-09 20:42:07.760000; Lifecycle Status: Active; Part Number: ERJ-3EKF1912V; Minimum Order: 1; Number of Terminations: 2; Operating Temperature: -55°C ~ 155°C; Package / Case: 0603 (1608 Metric); Packaging: TapeAndReel; PartId: 24830; Part Status: Active; Price: 0.01; Ratings: AEC-Q200; Resistance: 19.1 kOhms; Series: ERJ-3EK; Size / Dimension: 0.063\ L x 0.031\ W (1.60mm x 0.80mm); Supplier 1: DigiKey; Supplier Part Number 1: P19.1KHCT-ND; Supplier Device Package: 0603; Tolerance: ±1%; Value: 19.1 kOhms
R32 = ERJ-3EKF2801V: RES SMD 2.8K OHM 1% 1/10W 0603; Manufacturer: Panasonic Electronic Components; Power (Watts): 0.1W 1/10W; Temperature Coefficient: ±100ppm/°C; ComponentLink1Description: Datasheet; ComponentLink1URL: https://industrial.panasonic.com/cdbs/www-data/pdf/RDA0000/AOA0000C304.pdf; ComponentLink2Description: DigiKey Link; ComponentLink2URL: https://www.digikey.com/en/products/detail/panasonic-electronic-components/ERJ-3EKF2801V/196198; Composition: Thick Film; Device Package: 0603 (1608 Metric); Features: Automotive AEC-Q200; Height - Seated (Max): 0.022\ (0.55mm); LastUpdated: 2024-02-09 20:42:22.487000; Lifecycle Status: Active; Part Number: ERJ-3EKF2801V; Minimum Order: 1; Number of Terminations: 2; Operating Temperature: -55°C ~ 155°C; Package / Case: 0603 (1608 Metric); Packaging: TapeAndReel; PartId: 23129; Part Status: Active; Price: 0.01; Ratings: AEC-Q200; Resistance: 2.8 kOhms; Series: ERJ-3EK; Size / Dimension: 0.063\ L x 0.031\ W (1.60mm x 0.80mm); Supplier 1: DigiKey; Supplier Part Number 1: P2.80KHCT-ND; Supplier Device Package: 0603; Tolerance: ±1%; Value: 2.8 kOhms
R33 = ERJ-3EKF1432V: RES SMD 14.3K OHM 1% 1/10W 0603; Manufacturer: Panasonic Electronic Components; Power (Watts): 0.1W 1/10W; Temperature Coefficient: ±100ppm/°C; ComponentLink1Description: Datasheet; ComponentLink1URL: https://industrial.panasonic.com/cdbs/www-data/pdf/RDA0000/AOA0000C304.pdf; ComponentLink2Description: DigiKey Link; ComponentLink2URL: https://www.digikey.com/en/products/detail/panasonic-electronic-components/ERJ-3EKF1432V/97438; Composition: Thick Film; Device Package: 0603 (1608 Metric); Features: Automotive AEC-Q200; Height - Seated (Max): 0.022\ (0.55mm); LastUpdated: 2024-02-09 20:41:56.467000; Lifecycle Status: Active; Part Number: ERJ-3EKF1432V; Minimum Order: 1; Number of Terminations: 2; Operating Temperature: -55°C ~ 155°C; Package / Case: 0603 (1608 Metric); Packaging: TapeAndReel; PartId: 26065; Part Status: Active; Price: 0.01; Ratings: AEC-Q200; Resistance: 14.3 kOhms; Series: ERJ-3EK; Size / Dimension: 0.063\ L x 0.031\ W (1.60mm x 0.80mm); Supplier 1: DigiKey; Supplier Part Number 1: P14.3KHCT-ND; Supplier Device Package: 0603; Tolerance: ±1%; Value: 14.3 kOhms
R71 R72 = ERJ-PA3F1000V: RES SMD 100 OHM 1% 1/3W 0603; Manufacturer: Panasonic Electronic Components; Power (Watts): 0.333W 1/3W; Temperature Coefficient: ±100ppm/°C; ComponentLink1Description: Datasheet; ComponentLink1URL: https://industrial.panasonic.com/cdbs/www-data/pdf/RDO0000/AOA0000C331.pdf; ComponentLink2Description: DigiKey Link; ComponentLink2URL: https://www.digikey.com/en/products/detail/panasonic-electronic-components/ERJ-PA3F1000V/5035847; Composition: Thick Film; Device Package: 0603 (1608 Metric); Features: Automotive AEC-Q200 Pulse Withstanding; Height - Seated (Max): 0.022\ (0.55mm); LastUpdated: 2024-02-09 20:42:52.130000; Lifecycle Status: Active; Part Number: ERJ-PA3F1000V; Minimum Order: 1; Number of Terminations: 2; Operating Temperature: -55°C ~ 155°C; Package / Case: 0603 (1608 Metric); Packaging: TapeAndReel; PartId: 16197; Part Status: Active; Price: 0.01; Ratings: AEC-Q200; Resistance: 100 Ohms; Series: ERJ-PA3; Size / Dimension: 0.063\ L x 0.031\ W (1.60mm x 0.80mm); Supplier 1: DigiKey; Supplier Part Number 1: P100BYCT-ND; Supplier Device Package: 0603; Tolerance: ±1%; Value: 100 Ohms
U1 U22 U23 = ADAQ7769-1BBCZ: High Input Impedance, Programmable Gain, 24-Bit, 1MSPS, Alias-Free Î¼ModuleÂ® DAQ Solution; Manufacturer_Name: Analog Devices Inc; Copyright: Copyright (C) 2026 Ultra Librarian. All rights reserved.; Manufacturer_Part_Number: ADAQ7769-1BBCZ; RefDes: RefDes; Type: Type
U2 = AD7415ARTZ-0500RL7: +/-0.5 degrees C Accurate, 10-Bit Digital Temperature Sensor, 2.7 to 5.5 V Supply, Industrial, 5-pin SOT23 (RJ-5), Reel; Manufacturer: Analog Devices; Code_JEDEC: MO-178-AA; ComponentLink3URL: http://www.analog.com/static/imported-files/packages/PKG_PDF/SOT-23(RJ)/RJ_5.pdf; ComponentLink3Description: Package Specification; PartNumber: AD7415ARTZ-0500RL7; PackageDescription: 5-Pin Small Outline Transistor Package, Body 2.9 x 1.6 mm, Pitch 0.95 mm; Supply Voltage Range: 2.7 to 5.5 V; Packing: Reel; DatasheetVersion: Rev. F; Mounting Technology: Surface Mount; PackageVersion: 121608-A , 12/2008; ComponentLink1URL: http://www.analog.com/en/index.html; PackageReference: RJ-5; ComponentLink4Description: Product URL; ComponentLink4URL: http://www.analog.com/en/mems-sensors/digital-temperature-sensors/ad7415/products/product.html; ComponentLink2Description: Datasheet; ComponentLink2URL: http://www.analog.com/static/imported-files/data_sheets/AD7414_7415.pdf; ComponentLink1Description: Manufacturer URL
U8 U11 U15 U17 = ADCMP600BKSZ-R2: Rail-to-Rail, Very Fast, 2.5 V to 5.5 V, Single-Supply TTL/CMOS Comparator in 5-lead SC70 and SOT-23 Packages; Manufacturer_Name: Analog Devices Inc; Copyright: Copyright (C) 2026 Ultra Librarian. All rights reserved.; Manufacturer_Part_Number: ADCMP600BKSZ-R2; Datasheet: https://www.analog.com/media/en/technical-documentation/data-sheets/ADCMP600_601_602.pdf; RefDes: RefDes; Type: Type
U9 U13 = ADG6412BCPZ-REEL7: 0.5 mR RON, ±20 V, +36 V, Quad SPST Switch; Manufacturer_Name: Analog Devices Inc; Type: Interface; Copyright: Copyright (C) 2026 Ultra Librarian. All rights reserved.; Manufacturer_Part_Number: ADG6412BCPZ-REEL7; RefDes: RefDes
U10 U14 U16 = AD8411AWBRMZ: 2 V to 70 V Wide Input Voltage Range, 2.7 MHz High Bandwidth, Current-Sense Amplifier with PWM Rejection and Gain 50 V/V; Manufacturer_Name: Analog Devices Inc; Type: Linear; Copyright: Copyright (C) 2026 Ultra Librarian. All rights reserved.; Manufacturer_Part_Number: AD8411AWBRMZ; RefDes: RefDes
U12 = CMP-04903-000067-1: IC GATE NOR 4CH 2-INP 14TSSOP
U18 = CMP-09137-000153-1: IC VREF SERIES 0.02% 8SOIC; Temperature Coefficient: 1ppm/°C; Output Current: 10mA; Output Type: Fixed; Min Output Voltage: 4.096V; Operating Supply Current: 950uA; Case/Package: SOIC; RoHS Compliant: Yes; Max Operating Temperature: 70°C; Tolerance: 0.02%; Min Operating Temperature: 0°C; Series: -; Mount: Surface Mount; Reference Type: Series
U20 = CMP-04855-000004-1: IC CLK BUFFER 1:4 250MHZ 8TSSOP; Manufacturer: Texas Instruments; Logic Function: Non-Inverting; Number Of Outputs: 4; Min Supply Voltage: 2.3V; Nominal Supply Current: 3-6mA; Propagation Delay: 2ns; Standoff Height: 0.05mm; Max Supply Voltage: 3.6V; Number Of Elements: 1; Max Junction Temp: +125°C; Temperature: -40°C to +85°C; Height: 1.2mm; Device Class L2: Clock and Timing; Lead Free: Yes; ComponentLink2Description: Datasheet; Ambient Temperature Range Low: -40°C; Mouser Description: Clock Buffer Lo Jitter,1:4 LVCMOS Fan-out Clock Buffer; Category: IC; Temperature Range Low: -40°C; ComponentLink2URL: http://www.ti.com/lit/ds/symlink/cdclvc1104.pdf; Temperature Range High: +85°C; Octopart: https://octopart.com/cdclvc1104pwr-texas+instruments-18629864; Automotive: No; RoHS: TRUE; Device Class L1: Integrated Circuits (ICs); Number Of Inputs: 1; Ambient Temperature Range High: +85°C; Digikey Description: IC CLK BUFFER 1:4 250MHZ 8TSSOP; Package: PW0008A; Device Class L3: Clock Buffers; Manufacturer Part Number: CDCLVC1104PWR
U21 = CMP-09137-000009-1: IC VREF SERIES 0.1% TSOT23-6; Max Output Voltage: 5V; Quiescent Current: 1uA; Max Input Voltage: 18V; Number of Channels: 1; Temperature Coefficient: 20ppm/°C; Output Current: 5mA; Min Input Voltage: 5.5V; Tolerance: 0.1%; Mount: Surface Mount; Number of Pins: 6; Case/Package: SOT-23-6; Max Operating Temperature: 70°C; Package Quantity: 1; Min Operating Temperature: 0°C; RoHS Compliant: Yes; Reference Voltage: 5V; REACH SVHC: No SVHC; Output Voltage: 5V; Packaging: Cut Tape; Reference Type: Series; Series: -
U24 U25 = ADG5204BCPZ-RL7: High Voltage, Latch-up Proof, 4-Channel Multiplexer; Manufacturer_Name: Analog Devices Inc; Copyright: Copyright (C) 2026 Ultra Librarian. All rights reserved.; Manufacturer_Part_Number: ADG5204BCPZ-RL7; Datasheet: https://www.analog.com/media/en/technical-documentation/data-sheets/ADG5204.pdf; RefDes: RefDes; Type: Type
Y1 = CMP-25159-264590-1: Frequency Stability: 10ppm; Max Supply Current: 33mA; Frequency: 16.384000MHz; Min Operating Temperature: -40°C; Mount: Surface Mount; Packaging: Tape and Reel; Max Operating Temperature: 85°C; Case/Package: SMD/SMT; Series: SIT8208; RoHS Compliant: Yes

## Sheet Power.SchDoc
size A3; SheetNumber: 2; SheetTotal: 5
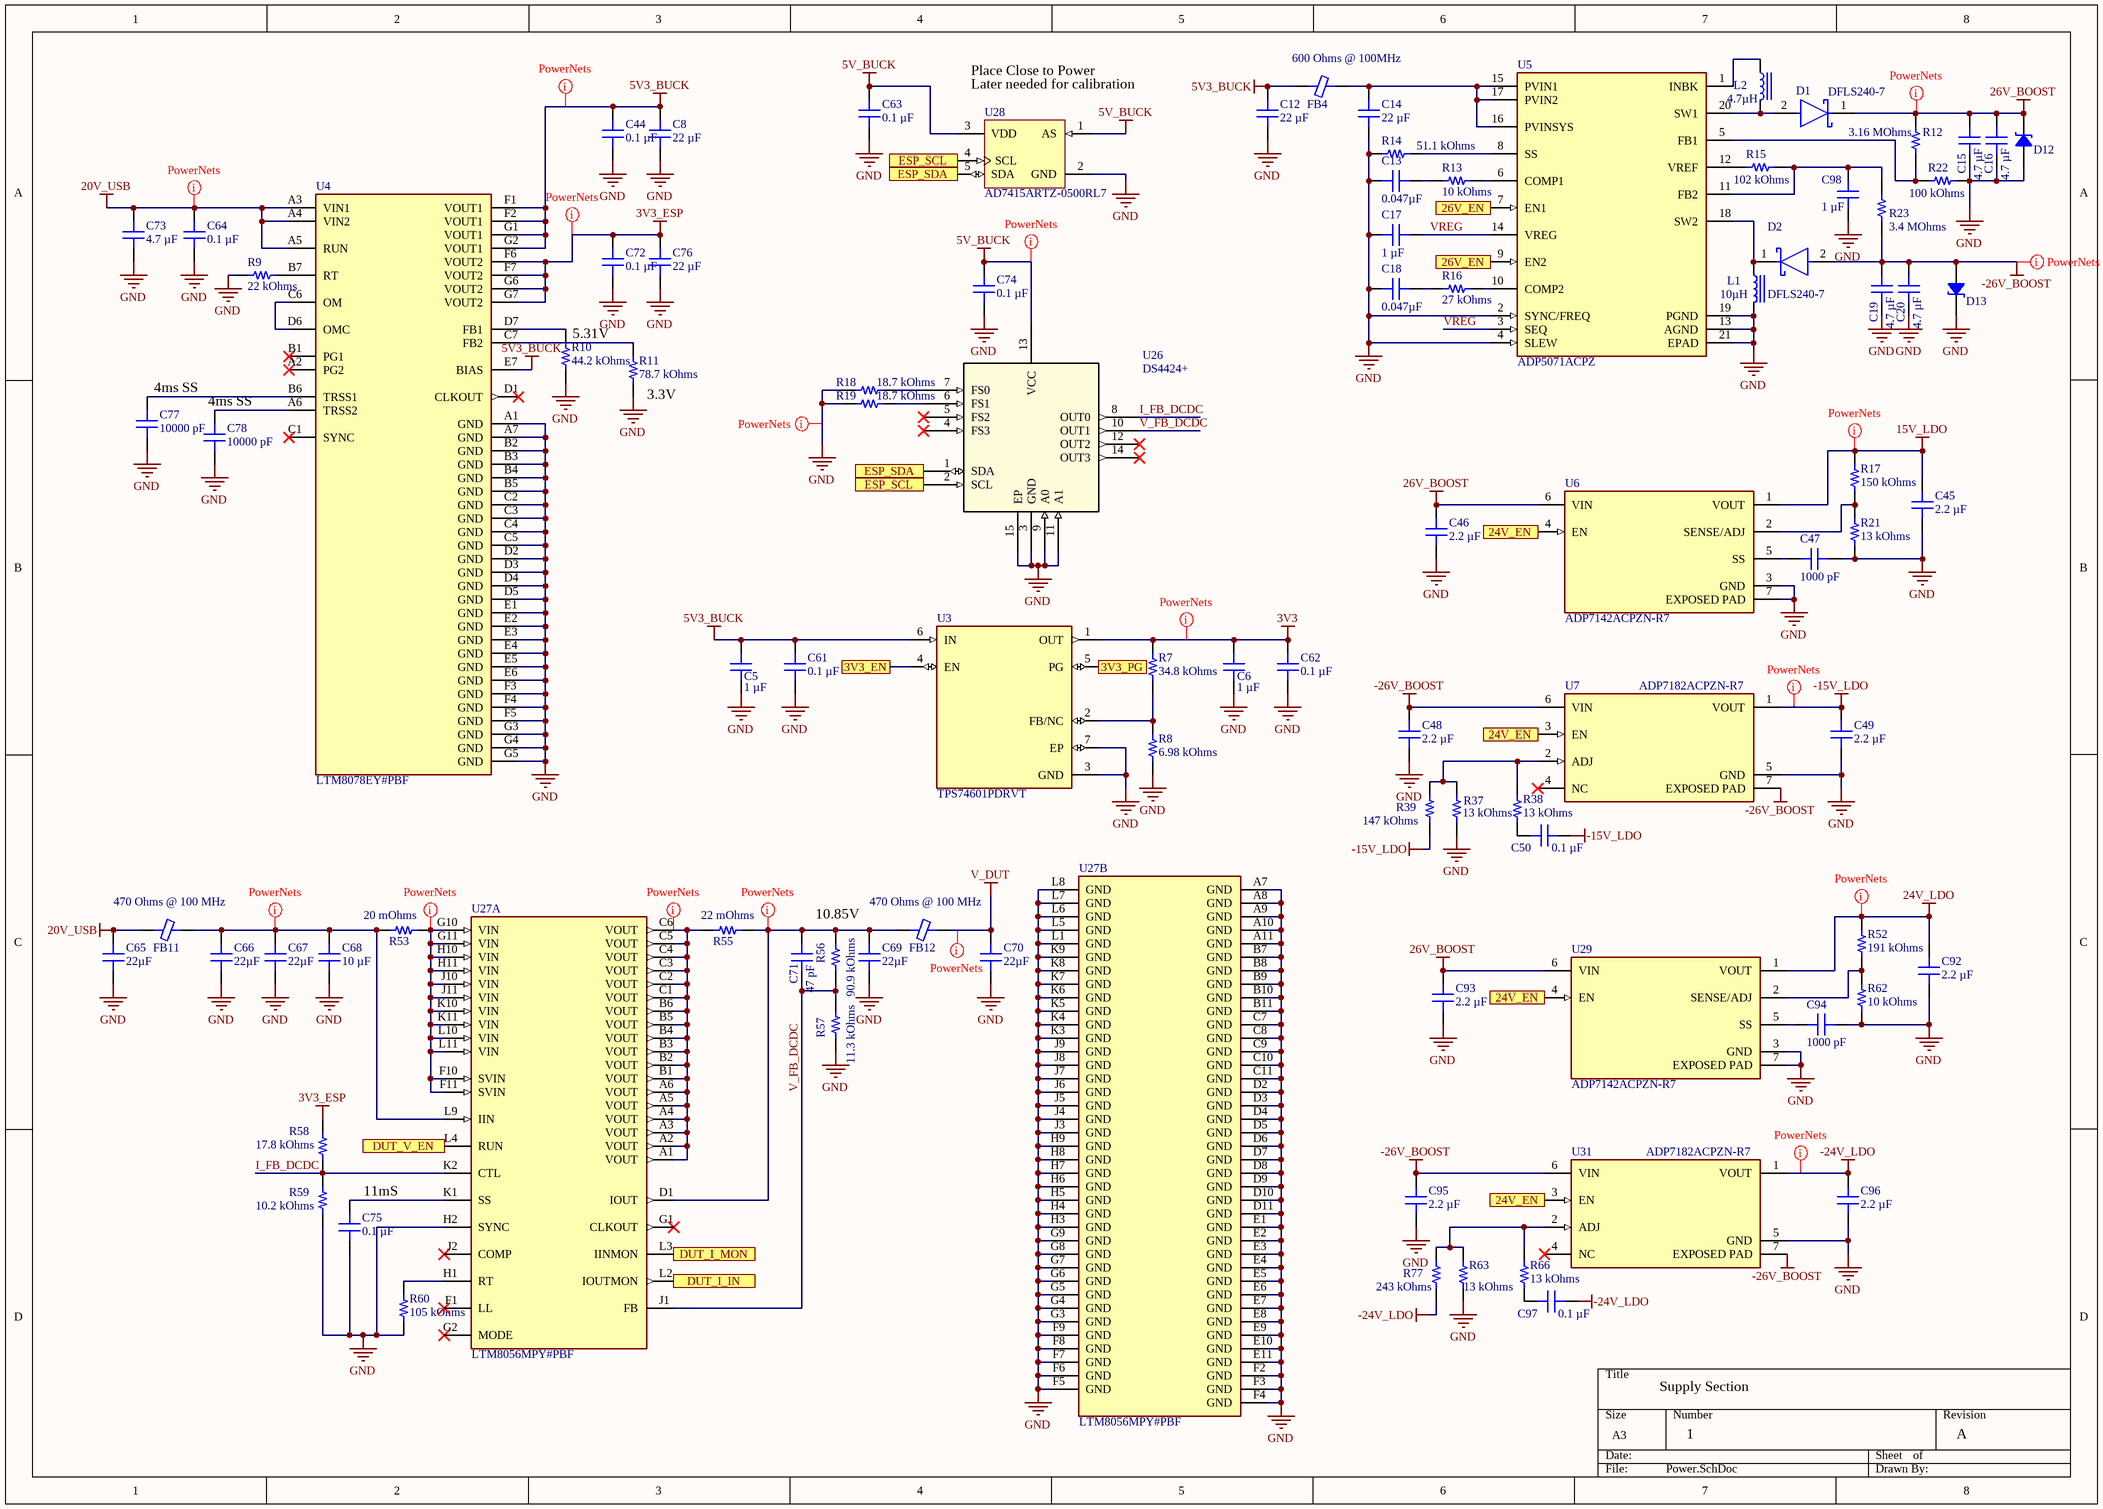
[diagram p2: Power.SchDoc]

### Parts
C5  1 µF  [CAP 0603_1608]
C6  1 µF  [CAP 0603_1608]
C8  22 µF  [CAP 0603_1608]
C12  22 µF  [CAP 0603_1608]
C13  0.047µF  [CAP 0603_1608]
C14  22 µF  [CAP 0603_1608]
C15  4.7 µF  [CAP 0805_2012]
C16  4.7 µF  [CAP 0805_2012]
C17  1 µF  [CAP 0603_1608]
C18  0.047µF  [CAP 0603_1608]
C19  4.7 µF  [CAP 0805_2012]
C20  4.7 µF  [CAP 0805_2012]
C44  0.1 µF  [CAP 0603_1608]
C45  2.2 µF  [CAP 0805_2012]
C46  2.2 µF  [CAP 0805_2012]
C47  1000 pF  [CAP 0603_1608]
C48  2.2 µF  [CAP 0805_2012]
C49  2.2 µF  [CAP 0805_2012]
C50  0.1 µF  [CAP 0603_1608]
C61  0.1 µF  [CAP 0603_1608]
C62  0.1 µF  [CAP 0603_1608]
C63  0.1 µF  [CAP 0603_1608]
C64  0.1 µF  [CAP 0603_1608]
C65  22µF  [CAP 2220_5650 3.0MM]
C66  22µF  [CAP 2220_5650 3.0MM]
C67  22µF  [CAP 2220_5650 3.0MM]
C68  10 µF  [CAP 1210_3225 - 1MM]
C69  22µF  [CAP 2220_5650 3.0MM]
C70  22µF  [CAP 2220_5650 3.0MM]
C71  47 pF  [CAP 0603_1608]
C72  0.1 µF  [CAP 0603_1608]
C73  4.7 µF  [CAP 0805_2012]
C74  0.1 µF  [CAP 0603_1608]
C75  0.1 µF  [CAP 0603_1608]
C76  22 µF  [CAP 0603_1608]
C77  10000 pF  [CAP 0603_1608]
C78  10000 pF  [CAP 0603_1608]
C92  2.2 µF  [CAP 0805_2012]
C93  2.2 µF  [CAP 0805_2012]
C94  1000 pF  [CAP 0603_1608]
C95  2.2 µF  [CAP 0805_2012]
C96  2.2 µF  [CAP 0805_2012]
C97  0.1 µF  [CAP 0603_1608]
C98  1 µF  [CAP 0603_1608]
D1  DFLS240-7  [FP-PowerDI123-MFG]
D2  DFLS240-7  [FP-PowerDI123-MFG]
D12  BZT52C27-7-F  [SOD-123]  (value not drawn)
D13  BZT52C27-7-F  [SOD-123]  (value not drawn)
FB4  600 Ohms @ 100MHz  [FER 0805_2012]
FB11  470 Ohms @ 100 MHz  [FER 1206_3216]
FB12  470 Ohms @ 100 MHz  [FER 1206_3216]
L1  10µH  [IND 1008_2520]
L2  4.7µH  [IND 1008_2520]
R7  34.8 kOhms  [RES 0603_1608]
R8  6.98 kOhms  [RES 0603_1608]
R9  22 kOhms  [RES 0603_1608]
R10  44.2 kOhms  [RES 0603_1608]
R11  78.7 kOhms  [RES 0603_1608]
R12  3.16 MOhms  [RES 0603_1608]
R13  10 kOhms  [RES 0603_1608]
R14  51.1 kOhms  [RES 0603_1608]
R15  102 kOhms  [RES 0603_1608]
R16  27 kOhms  [RES 0603_1608]
R17  150 kOhms  [RES 0603_1608]
R18  18.7 kOhms  [RES 0603_1608]
R19  18.7 kOhms  [RES 0603_1608]
R21  13 kOhms  [RES 0603_1608]
R22  100 kOhms  [RES 0603_1608]
R23  3.4 MOhms  [RES 0603_1608]
R37  13 kOhms  [RES 0603_1608]
R38  13 kOhms  [RES 0603_1608]
R39  147 kOhms  [RES 0603_1608]
R52  191 kOhms  [RES 0603_1608]
R53  20 mOhms  [STACKPOLE CSR1206]
R55  22 mOhms  [STACKPOLE CSR1206]
R56  90.9 kOhms  [RES 0603_1608]
R57  11.3 kOhms  [RES 0603_1608]
R58  17.8 kOhms  [RES 0603_1608]
R59  10.2 kOhms  [RES 0603_1608]
R60  105 kOhms  [RES 0603_1608]
R62  10 kOhms  [RES 0603_1608]
R63  13 kOhms  [RES 0603_1608]
R66  13 kOhms  [RES 0603_1608]
R77  243 kOhms  [RES 0603_1608]
U3  TPS74601PDRVT  [SON65P200X200X80-7N]
U4  LTM8078EY#PBF  [FP-BGA-49-05-08-1518-IPC_C]
U5  ADP5071ACPZ  [FP-CP-20-8-IPC_A]
U6  ADP7142ACPZN-R7  [FP-CP-6-3-IPC_B]
U7  ADP7182ACPZN-R7  [FP-CP-6-3-IPC_B]
U26  DS4424+  [21-0137_T1433+2_MXM]
U27  LTM8056MPY#PBF  [FP-BGA-121-05-08-1891-IPC_C]  (parts A,B of 2)
U28  AD7415ARTZ-0500RL7  [ADI-RJ-5_M]
U29  ADP7142ACPZN-R7  [FP-CP-6-3-IPC_B]
U31  ADP7182ACPZN-R7  [FP-CP-6-3-IPC_B]

### Ports
3V3_EN, 3V3_PG, 24V_EN, 26V_EN, DUT_I_IN, DUT_I_MON, DUT_V_EN, ESP_SCL, ESP_SDA

### Nets
3V3: C6.2 C62.2 R7.2 U3.1(OUT)
3V3_ESP: C72.2 C76.2 R58.2 U4.F6(VOUT2) U4.F7(VOUT2) U4.G6(VOUT2) U4.G7(VOUT2)
5V3_BUCK: C5.2 C8.2 C12.2 C44.2 C61.2 FB4.1 U3.6(IN) U4.E7(BIAS) U4.F1(VOUT1) U4.F2(VOUT1) U4.G1(VOUT1) U4.G2(VOUT1)
5V_BUCK: C63.2 C74.2 U26.13(VCC) U28.1(AS) U28.3(VDD)
15V_LDO: C45.2 R17.2 U6.1(VOUT)
20V_USB: C64.2 C65.2 C73.2 FB11.1 U4.A3(VIN1) U4.A4(VIN2) U4.A5(RUN)
24V_LDO: C92.2 R52.1 U29.1(VOUT)
26V_BOOST: C15.2 C16.2 C46.2 C93.2 D1.1(C) D12.2 R12.1 U6.6(VIN) U29.6(VIN)
-15V_LDO: C49.2 C50.1 R39.1 U7.1(VOUT)
-24V_LDO: C96.2 C97.1 R77.1 U31.1(VOUT)
-26V_BOOST: C19.2 C20.2 C48.2 C95.2 D2.2(A) D13.1 R23.1 U7.6(VIN) U7.7(EXPOSED_PAD) U31.6(VIN) U31.7(EXPOSED_PAD)
GND: C5.1 C6.1 C8.1 C12.1 C13.1 C14.1 C15.1 C16.1 C17.2 C18.1 C19.1 C20.1 C44.1 C45.1 C46.1 C47.2 C48.1 C49.1 C61.1 C62.1 C63.1 C64.1 C65.1 C66.1 C67.1 C68.1 C69.1 C70.1 C72.1 C73.1 C74.1 C75.1 C76.1 C77.1 C78.1 C92.1 C93.1 C94.2 C95.1 C96.1 C98.1 D12.1 D13.2 L1.2 R8.1 R9.1 R10.1 R11.1 R14.1 R18.1 R19.1 R21.1 R22.1 R37.1 R57.1 R59.1 R60.1 R62.1 R63.1 U3.3(GND) U3.7(EP) U4.A1(GND) U4.A7(GND) U4.B2(GND) U4.B3(GND) U4.B4(GND) U4.B5(GND) U4.C2(GND) U4.C3(GND) U4.C4(GND) U4.C5(GND) U4.D2(GND) U4.D3(GND) U4.D4(GND) U4.D5(GND) U4.E1(GND) U4.E2(GND) U4.E3(GND) U4.E4(GND) U4.E5(GND) U4.E6(GND) U4.F3(GND) U4.F4(GND) U4.F5(GND) U4.G3(GND) U4.G4(GND) U4.G5(GND) U5.2(SYNC/FREQ) U5.4(SLEW) U5.13(AGND) U5.19(PGND) U5.21(EPAD) U6.3(GND) U6.7(EXPOSED_PAD) U7.5(GND) U26.3(GND) U26.9(A0) U26.11(A1) U26.15(EP) U27.A7(GND) U27.A8(GND) U27.A9(GND) U27.A10(GND) U27.A11(GND) U27.B7(GND) U27.B8(GND) U27.B9(GND) U27.B10(GND) U27.B11(GND) U27.C7(GND) U27.C8(GND) U27.C9(GND) U27.C10(GND) U27.C11(GND) U27.D2(GND) U27.D3(GND) U27.D4(GND) U27.D5(GND) U27.D6(GND) U27.D7(GND) U27.D8(GND) U27.D9(GND) U27.D10(GND) U27.D11(GND) U27.E1(GND) U27.E2(GND) U27.E3(GND) U27.E4(GND) U27.E5(GND) U27.E6(GND) U27.E7(GND) U27.E8(GND) U27.E9(GND) U27.E10(GND) U27.E11(GND) U27.F2(GND) U27.F3(GND) U27.F4(GND) U27.F5(GND) U27.F6(GND) U27.F7(GND) U27.F8(GND) U27.F9(GND) U27.G3(GND) U27.G4(GND) U27.G5(GND) U27.G6(GND) U27.G7(GND) U27.G8(GND) U27.G9(GND) U27.H2(SYNC) U27.H3(GND) U27.H4(GND) U27.H5(GND) U27.H6(GND) U27.H7(GND) U27.H8(GND) U27.H9(GND) U27.J3(GND) U27.J4(GND) U27.J5(GND) U27.J6(GND) U27.J7(GND) U27.J8(GND) U27.J9(GND) U27.K3(GND) U27.K4(GND) U27.K5(GND) U27.K6(GND) U27.K7(GND) U27.K8(GND) U27.K9(GND) U27.L1(GND) U27.L5(GND) U27.L6(GND) U27.L7(GND) U27.L8(GND) U28.2(GND) U29.3(GND) U29.7(EXPOSED_PAD) U31.5(GND)
V_DUT: C70.2 FB12.2
I_FB_DCDC: R58.1 R59.2 U26.8(OUT0) U27.K2(CTL)
V_FB_DCDC: C71.1 R56.1 R57.2 U26.10(OUT1) U27.J1(FB)
VREG: C17.1 U5.3(SEQ) U5.14(VREG)
NetC13_2: C13.2 R13.1
NetC14_2: C14.2 FB4.2 U5.15(PVIN1) U5.16(PVINSYS) U5.17(PVIN2)
NetC18_2: C18.2 R16.1
NetC47_1: C47.1 U6.5(SS)
NetC50_2: C50.2 R38.1
NetC66_2: C66.2 C67.2 C68.2 FB11.2 R53.1 U27.L9(IIN)
NetC69_2: C69.2 C71.2 FB12.1 R55.2 R56.2 U27.D1(IOUT)
NetC75_2: C75.2 U27.K1(SS)
NetC77_2: C77.2 U4.B6(TRSS1)
NetC78_2: C78.2 U4.A6(TRSS2)
NetC94_1: C94.1 U29.5(SS)
NetC97_2: C97.2 R66.1
NetC98_2: C98.2 R15.2 R23.2 U5.11(FB2)
NetD1_2: D1.2(A) L2.2 U5.20(SW1)
NetD2_1: D2.1(C) L1.1 U5.18(SW2)
NetL2_1: L2.1 U5.1(INBK)
NetR2_2: U6.4(EN) U7.3(EN) U29.4(EN) U31.3(EN) ; port 24V_EN
NetR3_2: U27.L4(RUN) ; port DUT_V_EN
NetR7_1: R7.1 R8.2 U3.2(FB/NC)
NetR9_2: R9.2 U4.B7(RT)
NetR10_2: R10.2 U4.D7(FB1)
NetR11_2: R11.2 U4.C7(FB2)
NetR12_2: R12.2 R22.2 U5.5(FB1)
NetR13_2: R13.2 U5.6(COMP1)
NetR14_2: R14.2 U5.8(SS)
NetR15_1: R15.1 U5.12(VREF)
NetR16_2: R16.2 U5.10(COMP2)
NetR17_1: R17.1 R21.2 U6.2(SENSE/ADJ)
NetR18_2: R18.2 U26.7(FS0)
NetR19_2: R19.2 U26.6(FS1)
NetR20_1: U3.4(EN) ; port 3V3_EN
NetR37_2: R37.2 R38.2 R39.2 U7.2(ADJ)
NetR41_1: U5.7(EN1) U5.9(EN2) ; port 26V_EN
NetR51_1: U3.5(PG) ; port 3V3_PG
NetR52_2: R52.2 R62.2 U29.2(SENSE/ADJ)
NetR53_2: R53.2 U27.F10(SVIN) U27.F11(SVIN) U27.G10(VIN) U27.G11(VIN) U27.H10(VIN) U27.H11(VIN) U27.J10(VIN) U27.J11(VIN) U27.K10(VIN) U27.K11(VIN) U27.L10(VIN) U27.L11(VIN)
NetR55_1: R55.1 U27.A1(VOUT) U27.A2(VOUT) U27.A3(VOUT) U27.A4(VOUT) U27.A5(VOUT) U27.A6(VOUT) U27.B1(VOUT) U27.B2(VOUT) U27.B3(VOUT) U27.B4(VOUT) U27.B5(VOUT) U27.B6(VOUT) U27.C1(VOUT) U27.C2(VOUT) U27.C3(VOUT) U27.C4(VOUT) U27.C5(VOUT) U27.C6(VOUT)
NetR60_2: R60.2 U27.H1(RT)
NetR63_2: R63.2 R66.2 R77.2 U31.2(ADJ)
NetR68_1: U26.1(SDA) U28.5(SDA) ; port ESP_SDA
NetR69_1: U26.2(SCL) U28.4(SCL) ; port ESP_SCL
NetU4_C6: U4.C6(OM) U4.D6(OMC)
NetU27_L2: U27.L2(IOUTMON) ; port DUT_I_IN
NetU27_L3: U27.L3(IINMON) ; port DUT_I_MON

Not connected (* = marked no-connect by the designer): U4 A2(PG2)* B1(PG1)* C1(SYNC)* D1(CLKOUT)*; U7 4(NC)*; U26 4(FS3)* 5(FS2)* 12(OUT2)* 14(OUT3)*; U27 F1(LL)* G1(CLKOUT)* G2(MODE)* J2(COMP)*; U31 4(NC)*

### Layout directives
net class PowerNets: 3V3, 3V3_ESP, 5V3_BUCK, 5V_BUCK, 15V_LDO, 20V_USB, 24V_LDO, 26V_BOOST, -15V_LDO, -24V_LDO, -26V_BOOST, GND, NetC66_2, NetC69_2, NetR53_2, NetR55_1, V_DUT

### Notes on the sheet
- Place Close to Power
- (near U28) Later needed for calibration
- (near R10) 5.31V
- (near C77) 4ms SS
- (near C78) 4ms SS
- (near R11) 3.3V
- 10.85V
- (near C75) 11mS
- Supply Section
- 1
- A